# EAGLE schematic BlueBoard_v1 (EAGLE 6.2)

## Sheet 1 of 6: Microcontroller
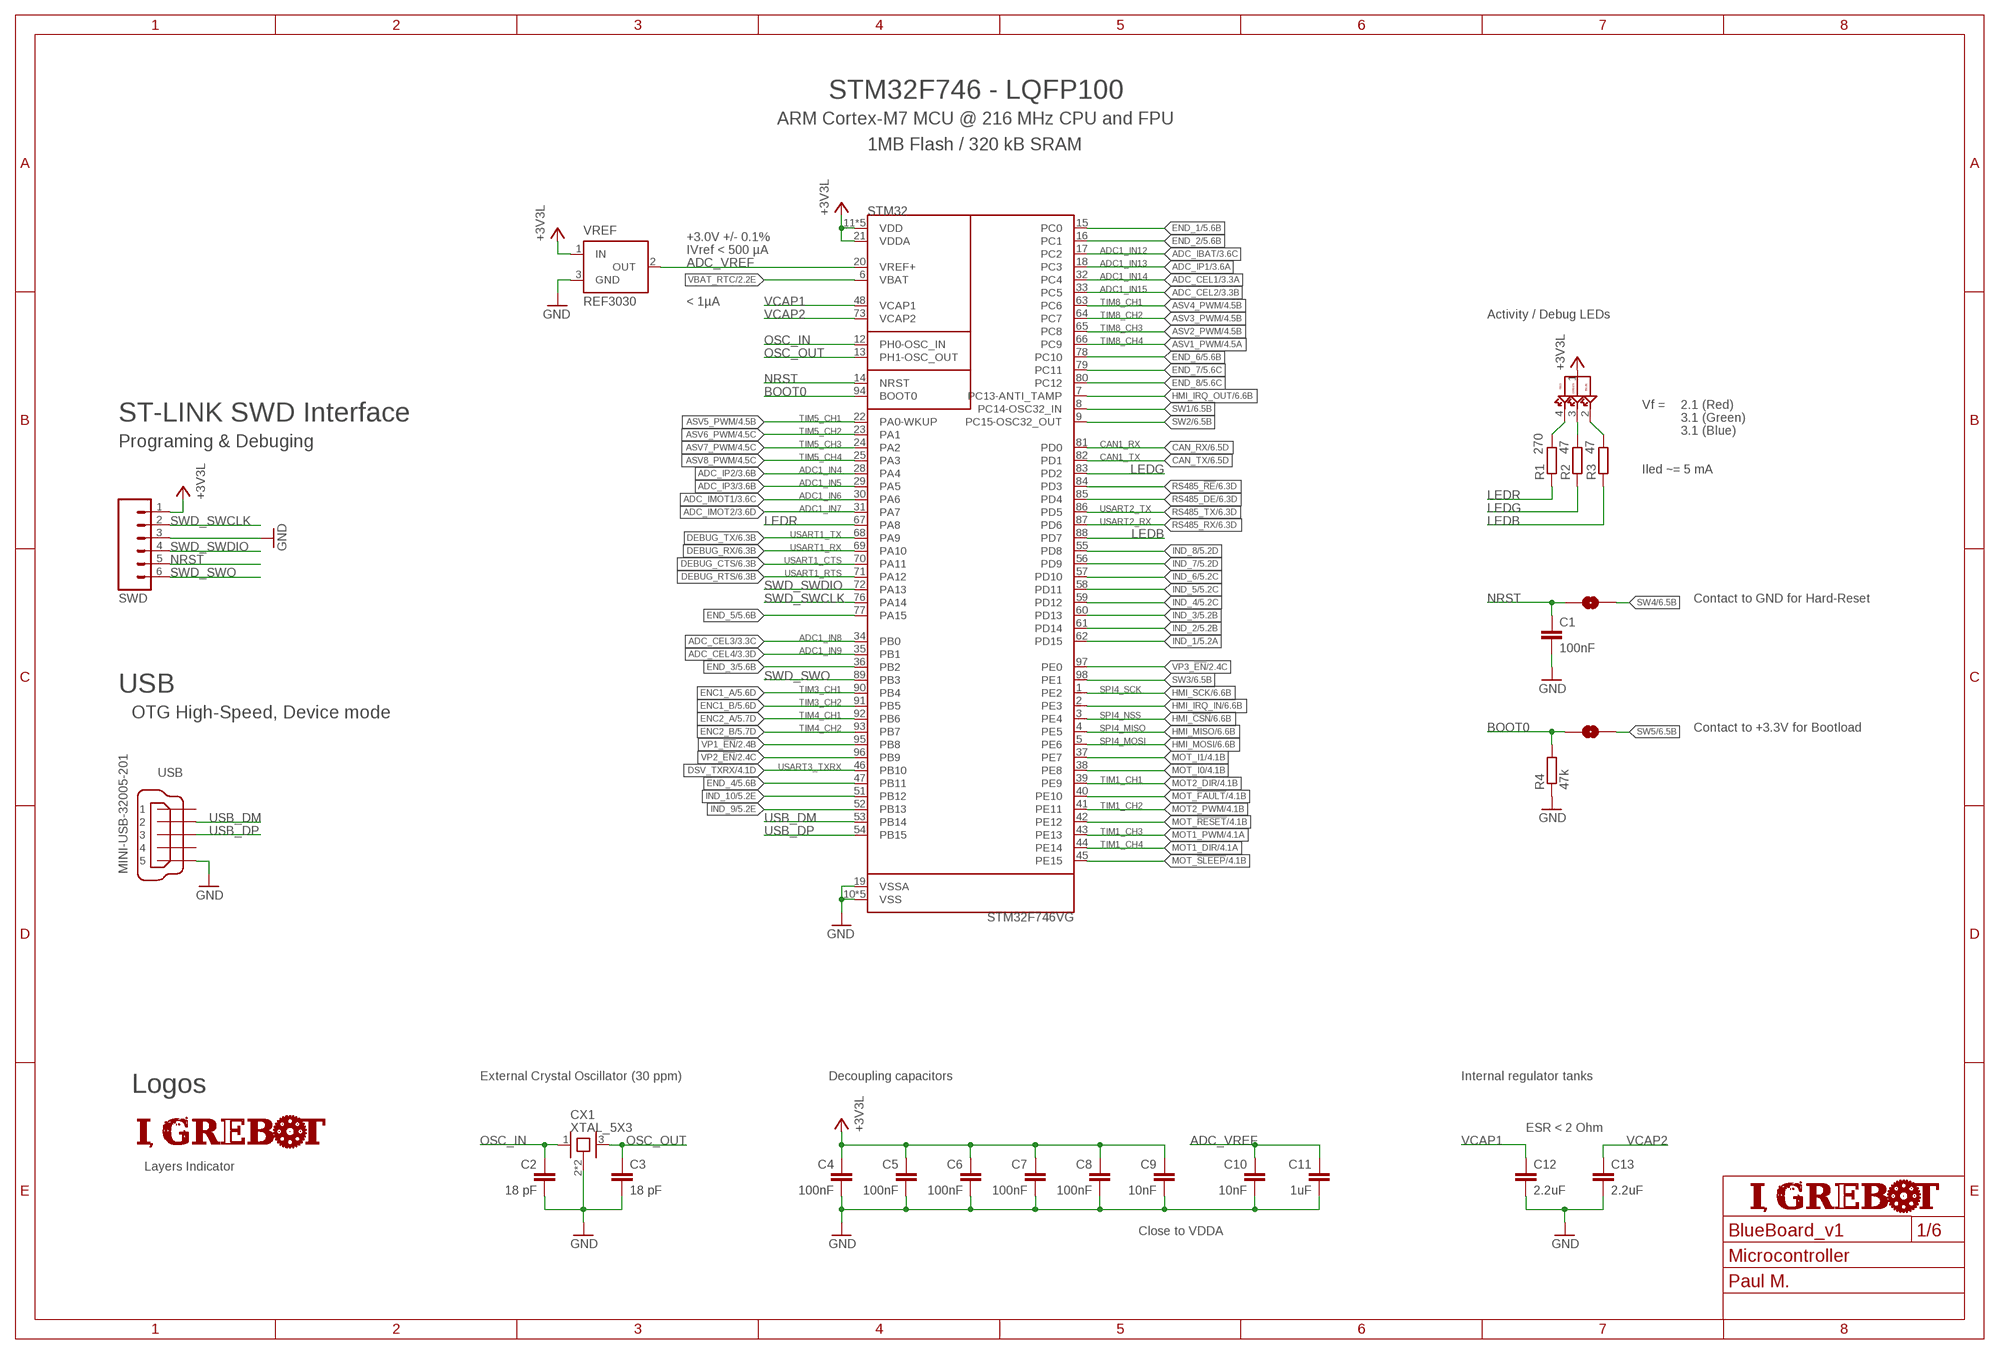
[diagram p0: schematic, sheet 1]
POWER-SUPPLIES1 (FRAME_A3): AUTHOR: Paul M.; SHEET_NAME: Microcontroller

### Parts
C1  100nF  C-EUC0603  [C0603]
C2  18 pF  C-EUC0603  [C0603]
C3  18 pF  C-EUC0603  [C0603]
C4  100nF  C-EUC0603  [C0603]
C5  100nF  C-EUC0603  [C0603]
C6  100nF  C-EUC0603  [C0603]
C7  100nF  C-EUC0603  [C0603]
C8  100nF  C-EUC0603  [C0603]
C9  10nF  C-EUC0603  [C0603]
C10  10nF  C-EUC0603  [C0603]
C11  1uF  C-EUC0805  [C0805]
C12  2.2uF  C-EUC0805  [C0805]
C13  2.2uF  C-EUC0805  [C0805]
CX1  XTAL_5X3  [CRYSTAL-OSC-SMD-5X3]
LED1  ASMB-MTB0-0A3A2  [PLCC4]
LOGO_IGREBOT  LOGO_IGREBOT12X2MM  [IGREBOT_12X2MM]
LOGO_LAYERS  LAYERS_CHECK4_LAYERS  [LAYERS_CHECK_4]
R1  270  R-EU_R0603  [R0603]
R2  47  R-EU_R0603  [R0603]
R3  47  R-EU_R0603  [R0603]
R4  47k  R-EU_R0603  [R0603]
SJ1  SOLDERJUMPERNC2  [SJ_2S-NOTRACE]
SJ2  SOLDERJUMPERNC2  [SJ_2S-NOTRACE]
STM32  STM32F746VG  [LQFP_100]
SWD  M06LOCK  [1X06_LOCK]
USB  MINI-USB-32005-201  [32005-201]
VREF  REF3030  MAX6520  [SOT23]

### Nets
+3V3L: C4.1 C5.1 C6.1 C7.1 C8.1 C9.1 LED1.1(A) STM32.11(VDD) STM32.21(VDDA) STM32.27(VDD) STM32.50(VDD) STM32.75(VDD) STM32.100(VDD) SWD.1 VREF.1(IN) ; also sheet 2,3,4,5,6
ADC_CEL1: STM32.32(PC4) ; also sheet 3
ADC_CEL2: STM32.33(PC5) ; also sheet 3
ADC_CEL3: STM32.34(PB0) ; also sheet 3
ADC_CEL4: STM32.35(PB1) ; also sheet 3
ADC_IBAT: STM32.17(PC2) ; also sheet 3
ADC_IMOT1: STM32.30(PA6) ; also sheet 3
ADC_IMOT2: STM32.31(PA7) ; also sheet 3
ADC_IP1: STM32.18(PC3) ; also sheet 3
ADC_IP2: STM32.28(PA4) ; also sheet 3
ADC_IP3: STM32.29(PA5) ; also sheet 3
ADC_VREF: C10.1 C11.1 STM32.20(VREF+) VREF.2(OUT)
ASV1_PWM: STM32.66(PC9) ; also sheet 4
ASV2_PWM: STM32.65(PC8) ; also sheet 4
ASV3_PWM: STM32.64(PC7) ; also sheet 4
ASV4_PWM: STM32.63(PC6) ; also sheet 4
ASV5_PWM: STM32.22(PA0-WKUP) ; also sheet 4
ASV6_PWM: STM32.23(PA1) ; also sheet 4
ASV7_PWM: STM32.24(PA2) ; also sheet 4
ASV8_PWM: STM32.25(PA3) ; also sheet 4
BOOT0: R4.2 SJ2.1 STM32.94(BOOT0)
CAN_RX: STM32.81(PD0) ; also sheet 6
CAN_TX: STM32.82(PD1) ; also sheet 6
DEBUG_CTS: STM32.70(PA11) ; also sheet 6
DEBUG_RTS: STM32.71(PA12) ; also sheet 6
DEBUG_RX: STM32.69(PA10) ; also sheet 6
DEBUG_TX: STM32.68(PA9) ; also sheet 6
DSV_TXRX: STM32.46(PB10) ; also sheet 4
ENC1_A: STM32.90(PB4) ; also sheet 5
ENC1_B: STM32.91(PB5) ; also sheet 5
ENC2_A: STM32.92(PB6) ; also sheet 5
ENC2_B: STM32.93(PB7) ; also sheet 5
END_1: STM32.15(PC0) ; also sheet 5
END_2: STM32.16(PC1) ; also sheet 5
END_3: STM32.36(PB2) ; also sheet 5
END_4: STM32.47(PB11) ; also sheet 5
END_5: STM32.77(PA15) ; also sheet 5
END_6: STM32.78(PC10) ; also sheet 5
END_7: STM32.79(PC11) ; also sheet 5
END_8: STM32.80(PC12) ; also sheet 5
GND: C1.2 C2.2 C3.2 C4.2 C5.2 C6.2 C7.2 C8.2 C9.2 C10.2 C11.2 C12.2 C13.2 CX1.2 CX1.4 R4.1 STM32.10(VSS) STM32.19(VSSA) STM32.26(VSS) STM32.49(VSS) STM32.74(VSS) STM32.99(VSS) SWD.3 USB.5 VREF.3(GND) ; also sheet 2,3,4,5,6
HMI_!CSN!: STM32.3(PE4) ; also sheet 6
HMI_IRQ_IN: STM32.2(PE3) ; also sheet 6
HMI_IRQ_OUT: STM32.7(PC13-ANTI_TAMP) ; also sheet 6
HMI_MISO: STM32.4(PE5) ; also sheet 6
HMI_MOSI: STM32.5(PE6) ; also sheet 6
HMI_SCK: STM32.1(PE2) ; also sheet 6
IND_1: STM32.62(PD15) ; also sheet 5
IND_2: STM32.61(PD14) ; also sheet 5
IND_3: STM32.60(PD13) ; also sheet 5
IND_4: STM32.59(PD12) ; also sheet 5
IND_5: STM32.58(PD11) ; also sheet 5
IND_6: STM32.57(PD10) ; also sheet 5
IND_7: STM32.56(PD9) ; also sheet 5
IND_8: STM32.55(PD8) ; also sheet 5
IND_9: STM32.52(PB13) ; also sheet 5
IND_10: STM32.51(PB12) ; also sheet 5
LEDB: R3.1 STM32.88(PD7)
LEDG: R2.1 STM32.83(PD2)
LEDR: R1.1 STM32.67(PA8)
MOT1_DIR: STM32.44(PE14) ; also sheet 4
MOT1_PWM: STM32.43(PE13) ; also sheet 4
MOT2_DIR: STM32.39(PE9) ; also sheet 4
MOT2_PWM: STM32.41(PE11) ; also sheet 4
MOT_!FAULT!: STM32.40(PE10) ; also sheet 4
MOT_!RESET!: STM32.42(PE12) ; also sheet 4
MOT_!SLEEP!: STM32.45(PE15) ; also sheet 4
MOT_I0: STM32.38(PE8) ; also sheet 4
MOT_I1: STM32.37(PE7) ; also sheet 4
N$9: LED1.4(CR) R1.2
N$10: LED1.3(CG) R2.2
N$11: LED1.2(CB) R3.2
NRST: C1.1 SJ1.1 STM32.14(NRST) SWD.5
OSC_IN: C2.1 CX1.1 STM32.12(PH0-OSC_IN)
OSC_OUT: C3.1 CX1.3 STM32.13(PH1-OSC_OUT)
RS485_!RE!: STM32.84(PD3) ; also sheet 6
RS485_DE: STM32.85(PD4) ; also sheet 6
RS485_RX: STM32.87(PD6) ; also sheet 6
RS485_TX: STM32.86(PD5) ; also sheet 6
SW1: STM32.8(PC14-OSC32_IN) ; also sheet 6
SW2: STM32.9(PC15-OSC32_OUT) ; also sheet 6
SW3: STM32.98(PE1) ; also sheet 6
SW4: SJ1.2 ; also sheet 6
SW5: SJ2.2 ; also sheet 6
SWD_SWCLK: STM32.76(PA14) SWD.2
SWD_SWDIO: STM32.72(PA13) SWD.4
SWD_SWO: STM32.89(PB3) SWD.6
USB_DM: STM32.53(PB14) USB.2
USB_DP: STM32.54(PB15) USB.3
VBAT_RTC: STM32.6(VBAT) ; also sheet 2
VCAP1: C12.1 STM32.48(VCAP1)
VCAP2: C13.1 STM32.73(VCAP2)
VP1_!EN!: STM32.95(PB8) ; also sheet 2
VP2_!EN!: STM32.96(PB9) ; also sheet 2
VP3_!EN!: STM32.97(PE0) ; also sheet 2
Unconnected: USB.1 USB.4

### Notes on the sheet
- STM32F746 - LQFP100
- ARM Cortex-M7 MCU @ 216 MHz CPU and FPU
- 1MB Flash / 320 kB SRAM
- +3.0V +/- 0.1%
- IVref < 500 µA | ADC1_IN12
- ADC1_IN13
- ADC1_IN14
- ADC1_IN15
- < 1µA | TIM8_CH1
- TIM8_CH2 | Activity / Debug LEDs
- TIM8_CH3
- TIM8_CH4
- Vf = | 2.1 (Red)
- ST-LINK SWD Interface | TIM5_CH1 | 3.1 (Green)
- TIM5_CH2 | 3.1 (Blue)
- Programing & Debuging | TIM5_CH3 | CAN1_RX
- TIM5_CH4 | CAN1_TX
- ADC1_IN4 | Iled ~= 5 mA
- ADC1_IN5
- ADC1_IN6
- ADC1_IN7 | USART2_TX
- USART2_RX
- USART1_TX
- USART1_RX
- USART1_CTS
- USART1_RTS
- Contact to GND for Hard-Reset
- ADC1_IN8
- ADC1_IN9
- USB | TIM3_CH1 | SPI4_SCK
- TIM3_CH2
- OTG High-Speed, Device mode | TIM4_CH1 | SPI4_NSS
- TIM4_CH2 | SPI4_MISO | Contact to +3.3V for Bootload
- SPI4_MOSI
- USART3_TXRX
- TIM1_CH1
- TIM1_CH2
- TIM1_CH3
- TIM1_CH4
- External Crystal Oscillator (30 ppm) | Decoupling capacitors | Internal regulator tanks
- Logos
- ESR < 2 Ohm
- Close to VDDA

## Sheet 2 of 6: Power-Supplies
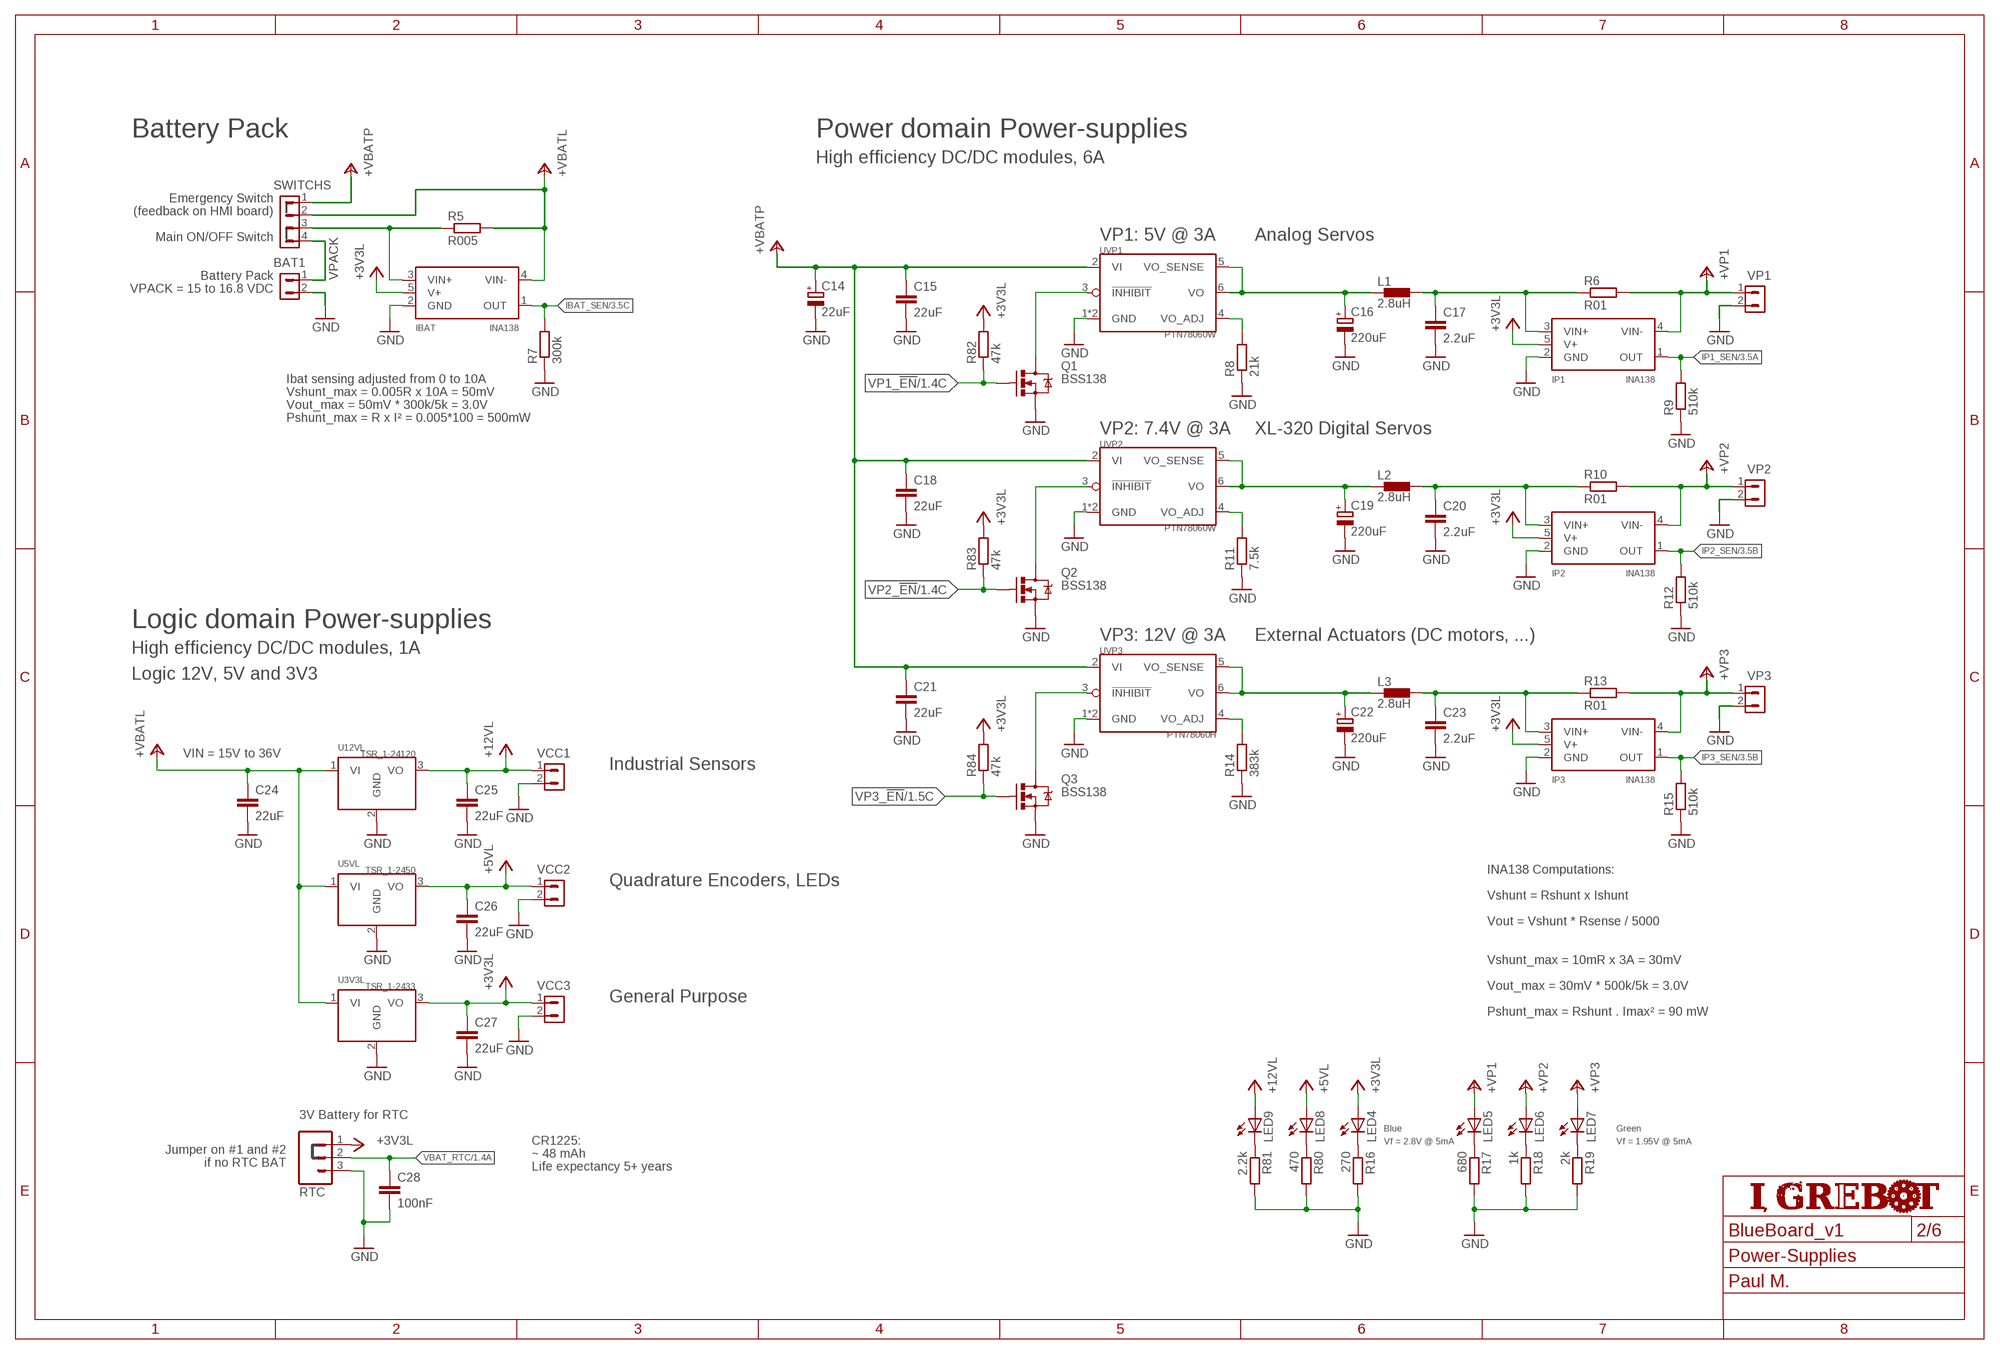
[diagram p1: schematic, sheet 2]
POWER-SUPPLIES (FRAME_A3): AUTHOR: Paul M.; SHEET_NAME: Power-Supplies

### Parts
BAT1  MC15-GF-3.81-LR_2  [CON_3.81_LR_2]
C14  22uF  CPOL-EUB  [PANASONIC_B]
C15  22uF  C-EUC3225  [C3225]
C16  220uF  CPOL-EUD  [PANASONIC_D]
C17  2.2uF  C-EUC3225  [C3225]
C18  22uF  C-EUC3225  [C3225]
C19  220uF  CPOL-EUD  [PANASONIC_D]
C20  2.2uF  C-EUC3225  [C3225]
C21  22uF  C-EUC3225  [C3225]
C22  220uF  CPOL-EUD  [PANASONIC_D]
C23  2.2uF  C-EUC3225  [C3225]
C24  22uF  C-EUC3225  [C3225]
C25  22uF  C-EUC1210  [C1210]
C26  22uF  C-EUC1210  [C1210]
C27  22uF  C-EUC1210  [C1210]
C28  100nF  C-EUC0603  [C0603]
IBAT  INA138  [DBV_05]
IP1  INA138  [DBV_05]
IP2  INA138  [DBV_05]
IP3  INA138  [DBV_05]
L1  2.8uH  DR1030  [DR1030]
L2  2.8uH  DR1030  [DR1030]
L3  2.8uH  DR1030  [DR1030]
LED4  LEDCHIP-LED0805  [CHIP-LED0805]
LED5  LEDCHIP-LED0805  [CHIP-LED0805]
LED6  LEDCHIP-LED0805  [CHIP-LED0805]
LED7  LEDCHIP-LED0805  [CHIP-LED0805]
LED8  LEDCHIP-LED0805  [CHIP-LED0805]
LED9  LEDCHIP-LED0805  [CHIP-LED0805]
Q1  BSS138  MOSFET-NCHANNELBSS138  [SOT23]
Q2  BSS138  MOSFET-NCHANNELBSS138  [SOT23]
Q3  BSS138  MOSFET-NCHANNELBSS138  [SOT23]
R5  R005  R-EU_R2512  [R2512]
R6  R01  R-EU_R2512  [R2512]
R7  300k  R-EU_R0603  [R0603]
R8  21k  R-EU_R0603  [R0603]
R9  510k  R-EU_R0603  [R0603]
R10  R01  R-EU_R2512  [R2512]
R11  7.5k  R-EU_R0603  [R0603]
R12  510k  R-EU_R0603  [R0603]
R13  R01  R-EU_R2512  [R2512]
R14  383k  R-EU_R0603  [R0603]
R15  510k  R-EU_R0603  [R0603]
R16  270  R-EU_R0603  [R0603]
R17  680  R-EU_R0603  [R0603]
R18  1k  R-EU_R0603  [R0603]
R19  2k  R-EU_R0603  [R0603]
R80  470  R-EU_R0603  [R0603]
R81  2.2k  R-EU_R0603  [R0603]
R82  47k  R-EU_R0603  [R0603]
R83  47k  R-EU_R0603  [R0603]
R84  47k  R-EU_R0603  [R0603]
RTC  M03LOCK  [1X03_LOCK]
SWITCHS  MC15-GF-3.81-LR_4  [CON_3.81_LR_4]
U3V3L  TSR_1-2433  TSR_1-24XX  [TSR1]
U5VL  TSR_1-2450  TSR_1-24XX  [TSR1]
U12VL  TSR_1-24120  TSR_1-24XX  [TSR1]
UVP1  PTN78060W  [PTN78060]
UVP2  PTN78060W  [PTN78060]
UVP3  PTN78060H  PTN78060W  [PTN78060]
VCC1  CON_3.5_2  [CON_3.5_2]
VCC2  CON_3.5_2  [CON_3.5_2]
VCC3  CON_3.5_2  [CON_3.5_2]
VP1  CON_3.5_2  [CON_3.5_2]
VP2  CON_3.5_2  [CON_3.5_2]
VP3  CON_3.5_2  [CON_3.5_2]

### Nets
!INHIBIT!_VP1: Q1.3(D) UVP1.3(!INHIBIT!)
!INHIBIT!_VP5: Q2.3(D) UVP2.3(!INHIBIT!)
!INHIBIT!_VP6: Q3.3(D) UVP3.3(!INHIBIT!)
+3V3L: C27.1 IBAT.5(V+) IP1.5(V+) IP2.5(V+) IP3.5(V+) LED4.A R82.2 R83.2 R84.2 RTC.1 U3V3L.3(VO) VCC3.1 ; also sheet 1,3,4,5,6
+5VL: C26.1 LED8.A U5VL.3(VO) VCC2.1 ; also sheet 3,5,6
+12VL: C25.1 LED9.A U12VL.3(VO) VCC1.1 ; also sheet 5
+VBATL: C24.1 IBAT.4(VIN-) R5.2 SWITCHS.2 U3V3L.1(VI) U5VL.1(VI) U12VL.1(VI)
+VBATP: C14.+ C15.1 C18.1 C21.1 SWITCHS.1 UVP1.2(VI) UVP2.2(VI) UVP3.2(VI) ; also sheet 4
+VP1: IP1.4(VIN-) LED5.A R6.2 VP1.1 ; also sheet 4
+VP2: IP2.4(VIN-) LED6.A R10.2 VP2.1 ; also sheet 4
+VP3: IP3.4(VIN-) LED7.A R13.2 VP3.1
GND: BAT1.2 C14.- C15.2 C16.- C17.2 C18.2 C19.- C20.2 C21.2 C22.- C23.2 C24.2 C25.2 C26.2 C27.2 C28.2 IBAT.2(GND) IP1.2(GND) IP2.2(GND) IP3.2(GND) Q1.2(S) Q2.2(S) Q3.2(S) R7.1 R8.1 R9.1 R11.1 R12.1 R14.1 R15.1 R16.2 R17.2 R18.2 R19.2 R80.2 R81.2 RTC.3 U3V3L.2(GND) U5VL.2(GND) U12VL.2(GND) UVP1.1(GND) UVP1.7(GND) UVP2.1(GND) UVP2.7(GND) UVP3.1(GND) UVP3.7(GND) VCC1.2 VCC2.2 VCC3.2 VP1.2 VP2.2 VP3.2 ; also sheet 1,3,4,5,6
IBAT_SEN: IBAT.1(OUT) R7.2 ; also sheet 3
IP1_SEN: IP1.1(OUT) R9.2 ; also sheet 3
IP2_SEN: IP2.1(OUT) R12.2 ; also sheet 3
IP3_SEN: IP3.1(OUT) R15.2 ; also sheet 3
N$1: C16.+ L1.1 UVP1.5(VO_SENSE) UVP1.6(VO)
N$3: C17.1 IP1.3(VIN+) L1.2 R6.1
N$4: R14.2 UVP3.4(VO_ADJ)
N$6: R11.2 UVP2.4(VO_ADJ)
N$7: C19.+ L2.1 UVP2.5(VO_SENSE) UVP2.6(VO)
N$8: R8.2 UVP1.4(VO_ADJ)
N$12: C20.1 IP2.3(VIN+) L2.2 R10.1
N$13: C22.+ L3.1 UVP3.5(VO_SENSE) UVP3.6(VO)
N$14: C23.1 IP3.3(VIN+) L3.2 R13.1
N$15: LED8.C R80.1
N$16: LED9.C R81.1
N$39: LED5.C R17.1
N$40: LED4.C R16.1
N$41: LED6.C R18.1
N$42: LED7.C R19.1
N$43: IBAT.3(VIN+) R5.1 SWITCHS.3
VBAT_RTC: C28.1 RTC.2 ; also sheet 1
VP1_!EN!: Q1.1(G) R82.1 ; also sheet 1
VP2_!EN!: Q2.1(G) R83.1 ; also sheet 1
VP3_!EN!: Q3.1(G) R84.1 ; also sheet 1
VPACK: BAT1.1 SWITCHS.4

### Notes on the sheet
- Battery Pack | Power domain Power-supplies
- High efficiency DC/DC modules, 6A
- Emergency Switch
- (feedback on HMI board)
- Main ON/OFF Switch | VP1: 5V @ 3A | Analog Servos
- Battery Pack
- VPACK = 15 to 16.8 VDC
- Ibat sensing adjusted from 0 to 10A
- Vshunt_max = 0.005R x 10A = 50mV
- Vout_max = 50mV * 300k/5k = 3.0V
- Pshunt_max = R x I² = 0.005*100 = 500mW
- VP2: 7.4V @ 3A | XL-320 Digital Servos
- Logic domain Power-supplies
- VP3: 12V @ 3A | External Actuators (DC motors, ...)
- High efficiency DC/DC modules, 1A
- Logic 12V, 5V and 3V3
- VIN = 15V to 36V
- Industrial Sensors
- INA138 Computations:
- Quadrature Encoders, LEDs
- Vshunt = Rshunt x Ishunt
- Vout = Vshunt * Rsense / 5000
- Vshunt_max = 10mR x 3A = 30mV
- Vout_max = 30mV * 500k/5k = 3.0V
- General Purpose
- Pshunt_max = Rshunt . Imax² = 90 mW
- 3V Battery for RTC
- Blue | Green
- Jumper on #1 and #2 | CR1225: | Vf = 2.8V @ 5mA | Vf = 1.95V @ 5mA
- if no RTC BAT | ~ 48 mAh
- Life expectancy 5+ years

## Sheet 3 of 6: Monitoring
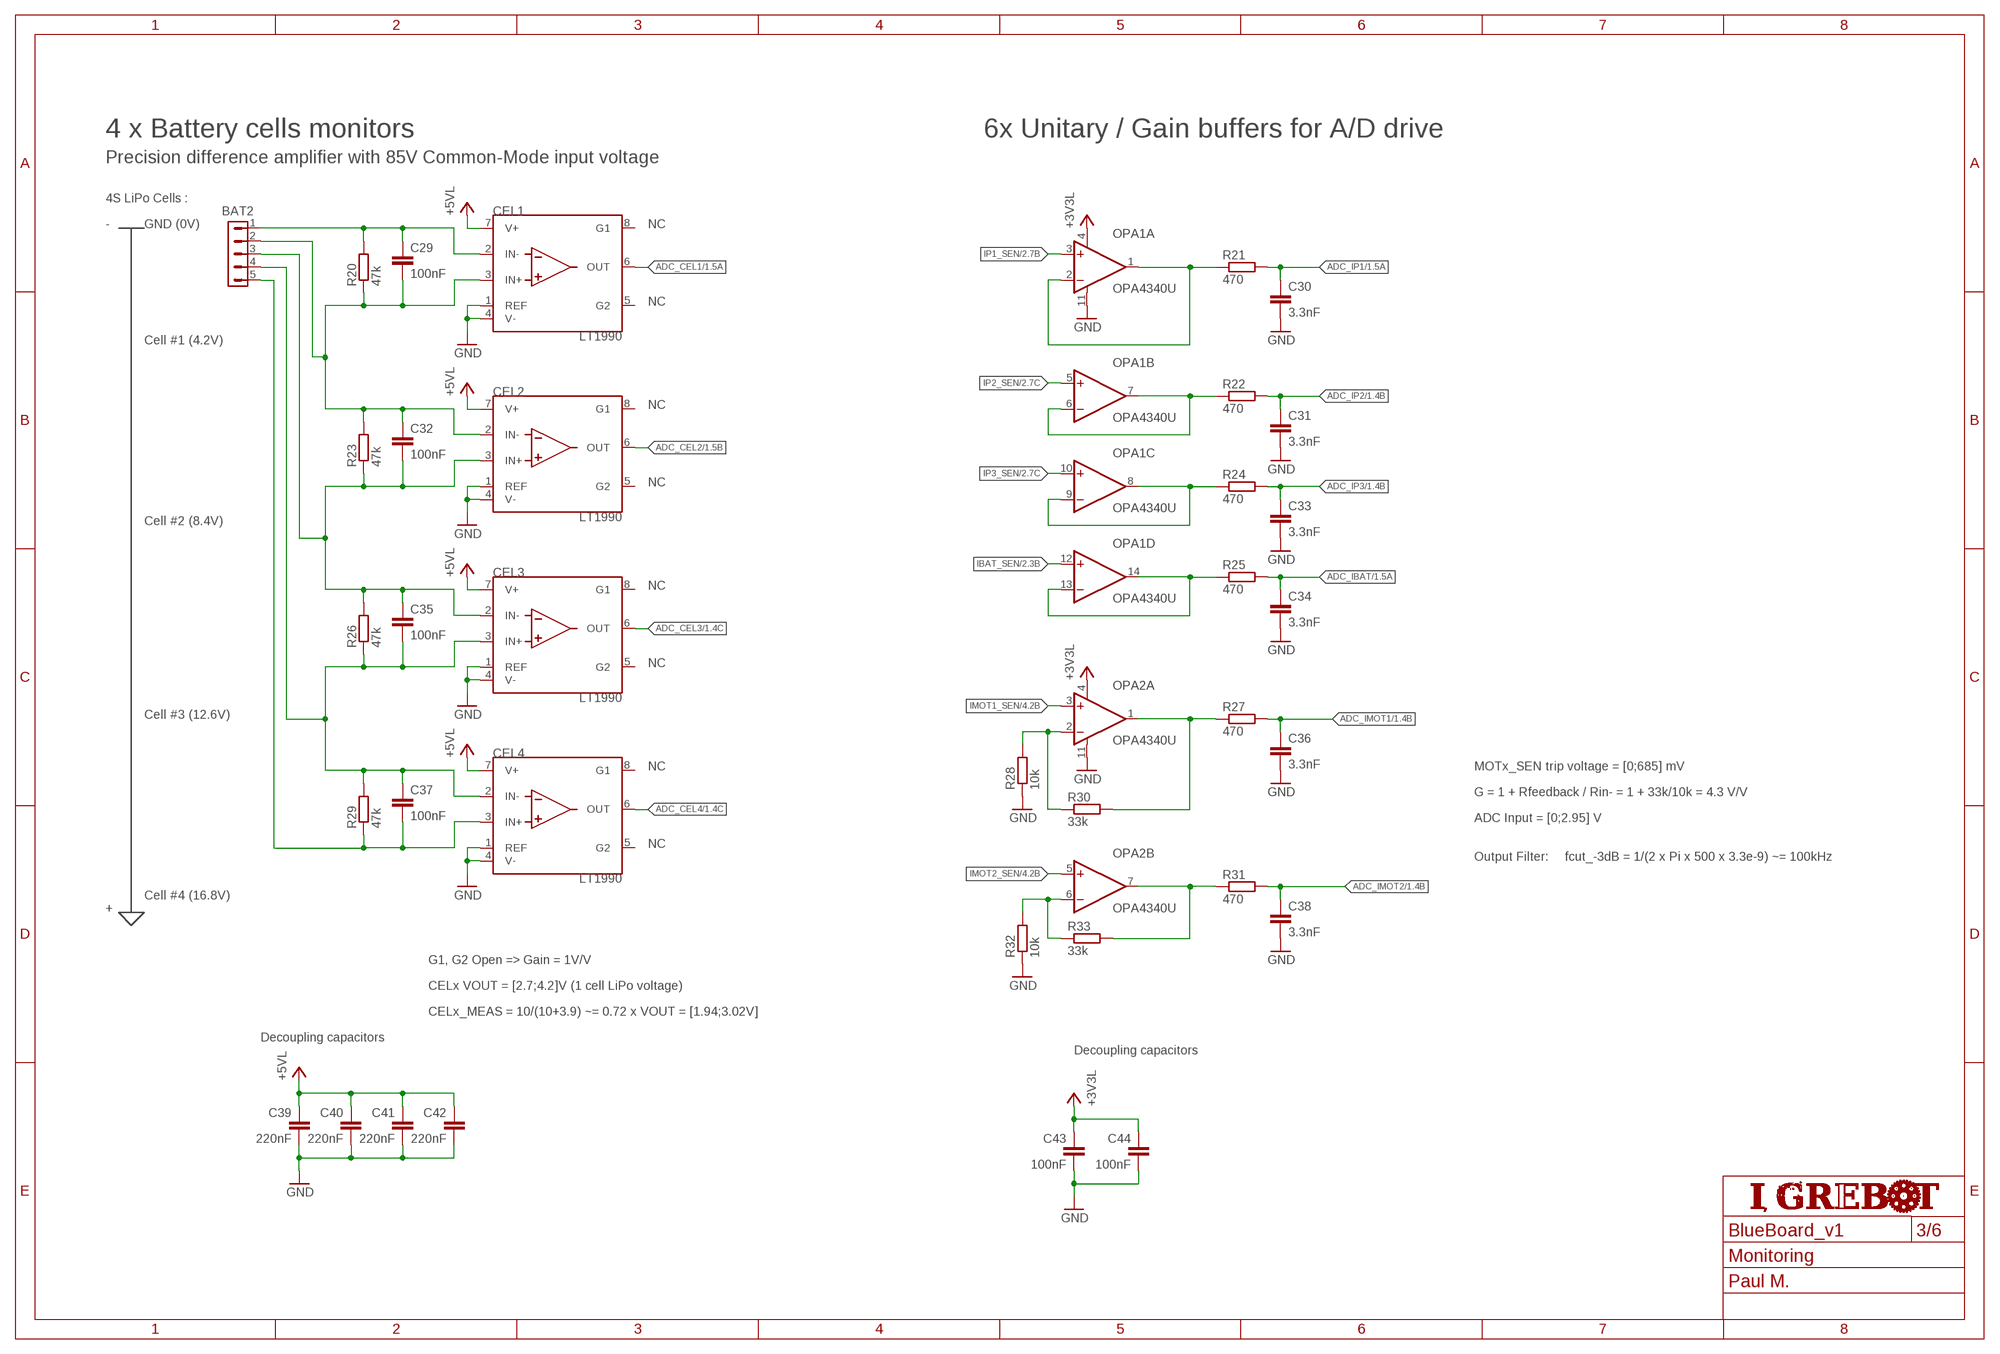
[diagram p2: schematic, sheet 3]
POWER-SUPPLIES2 (FRAME_A3): AUTHOR: Paul M.; SHEET_NAME: Monitoring

### Parts
BAT2  JST-XH-S_5  [JST-XH-5S]
C29  100nF  C-EUC0603  [C0603]
C30  3.3nF  C-EUC0603  [C0603]
C31  3.3nF  C-EUC0603  [C0603]
C32  100nF  C-EUC0603  [C0603]
C33  3.3nF  C-EUC0603  [C0603]
C34  3.3nF  C-EUC0603  [C0603]
C35  100nF  C-EUC0603  [C0603]
C36  3.3nF  C-EUC0603  [C0603]
C37  100nF  C-EUC0603  [C0603]
C38  3.3nF  C-EUC0603  [C0603]
C39  220nF  C-EUC0603  [C0603]
C40  220nF  C-EUC0603  [C0603]
C41  220nF  C-EUC0603  [C0603]
C42  220nF  C-EUC0603  [C0603]
C43  100nF  C-EUC0603  [C0603]
C44  100nF  C-EUC0603  [C0603]
CEL1  LT1990  [S8]
CEL2  LT1990  [S8]
CEL3  LT1990  [S8]
CEL4  LT1990  [S8]
OPA1  OPA4340U  [SO14]
OPA2  OPA4340U  [SO14]
R20  47k  R-EU_R0603  [R0603]
R21  470  R-EU_R0603  [R0603]
R22  470  R-EU_R0603  [R0603]
R23  47k  R-EU_R0603  [R0603]
R24  470  R-EU_R0603  [R0603]
R25  470  R-EU_R0603  [R0603]
R26  47k  R-EU_R0603  [R0603]
R27  470  R-EU_R0603  [R0603]
R28  10k  R-EU_R0603  [R0603]
R29  47k  R-EU_R0603  [R0603]
R30  33k  R-EU_R0603  [R0603]
R31  470  R-EU_R0603  [R0603]
R32  10k  R-EU_R0603  [R0603]
R33  33k  R-EU_R0603  [R0603]

### Nets
+3V3L: C43.1 C44.1 OPA1.4(A:V+) OPA2.4(A:V+) ; also sheet 1,2,4,5,6
+5VL: C39.1 C40.1 C41.1 C42.1 CEL1.7(V+) CEL2.7(V+) CEL3.7(V+) CEL4.7(V+) ; also sheet 2,5,6
ADC_CEL1: CEL1.6(OUT) ; also sheet 1
ADC_CEL2: CEL2.6(OUT) ; also sheet 1
ADC_CEL3: CEL3.6(OUT) ; also sheet 1
ADC_CEL4: CEL4.6(OUT) ; also sheet 1
ADC_IBAT: C34.1 R25.2 ; also sheet 1
ADC_IMOT1: C36.1 R27.2 ; also sheet 1
ADC_IMOT2: C38.1 R31.2 ; also sheet 1
ADC_IP1: C30.1 R21.2 ; also sheet 1
ADC_IP2: C31.1 R22.2 ; also sheet 1
ADC_IP3: C33.1 R24.2 ; also sheet 1
GND: C30.2 C31.2 C33.2 C34.2 C36.2 C38.2 C39.2 C40.2 C41.2 C42.2 C43.2 C44.2 CEL1.1(REF) CEL1.4(V-) CEL2.1(REF) CEL2.4(V-) CEL3.1(REF) CEL3.4(V-) CEL4.1(REF) CEL4.4(V-) OPA1.11(A:V-) OPA2.11(A:V-) R28.1 R32.1 ; also sheet 1,2,4,5,6
IBAT_SEN: OPA1.12(D:+IN) ; also sheet 2
IMOT1_SEN: OPA2.3(A:+IN) ; also sheet 4
IMOT2_SEN: OPA2.5(B:+IN) ; also sheet 4
IP1_SEN: OPA1.3(A:+IN) ; also sheet 2
IP2_SEN: OPA1.5(B:+IN) ; also sheet 2
IP3_SEN: OPA1.10(C:+IN) ; also sheet 2
N$5: OPA2.2(A:-IN) R28.2 R30.1
N$18: OPA2.6(B:-IN) R32.2 R33.1
N$61: OPA1.1(A:OUT) OPA1.2(A:-IN) R21.1
N$62: OPA1.6(B:-IN) OPA1.7(B:OUT) R22.1
N$63: OPA1.8(C:OUT) OPA1.9(C:-IN) R24.1
N$64: OPA1.13(D:-IN) OPA1.14(D:OUT) R25.1
N$65: OPA2.1(A:OUT) R27.1 R30.2
N$66: OPA2.7(B:OUT) R31.1 R33.2
N$104: BAT2.1 C29.1 CEL1.2(IN-) R20.2
N$105: BAT2.2 C29.2 C32.1 CEL1.3(IN+) CEL2.2(IN-) R20.1 R23.2
N$108: BAT2.3 C32.2 C35.1 CEL2.3(IN+) CEL3.2(IN-) R23.1 R26.2
N$111: BAT2.4 C35.2 C37.1 CEL3.3(IN+) CEL4.2(IN-) R26.1 R29.2
N$114: BAT2.5 C37.2 CEL4.3(IN+) R29.1
Unconnected: CEL1.5(G2) CEL1.8(G1) CEL2.5(G2) CEL2.8(G1) CEL3.5(G2) CEL3.8(G1) CEL4.5(G2) CEL4.8(G1) OPA2.8(C:OUT) OPA2.9(C:-IN) OPA2.10(C:+IN) OPA2.12(D:+IN) OPA2.13(D:-IN) OPA2.14(D:OUT)

### Notes on the sheet
- 4 x Battery cells monitors | 6x Unitary / Gain buffers for A/D drive
- Precision difference amplifier with 85V Common-Mode input voltage
- 4S LiPo Cells :
- - | GND (0V) | NC
- NC
- Cell #1 (4.2V)
- NC
- NC
- Cell #2 (8.4V)
- NC
- NC
- Cell #3 (12.6V)
- NC | MOTx_SEN trip voltage = [0;685] mV
- G = 1 + Rfeedback / Rin- = 1 + 33k/10k = 4.3 V/V
- ADC Input = [0;2.95] V
- NC
- Output Filter: | fcut_-3dB = 1/(2 x Pi x 500 x 3.3e-9) ~= 100kHz
- Cell #4 (16.8V)
- +
- G1, G2 Open => Gain = 1V/V
- CELx VOUT = [2.7;4.2]V (1 cell LiPo voltage)
- CELx_MEAS = 10/(10+3.9) ~= 0.72 x VOUT = [1.94;3.02V]
- Decoupling capacitors
- Decoupling capacitors

## Sheet 4 of 6: Actuators
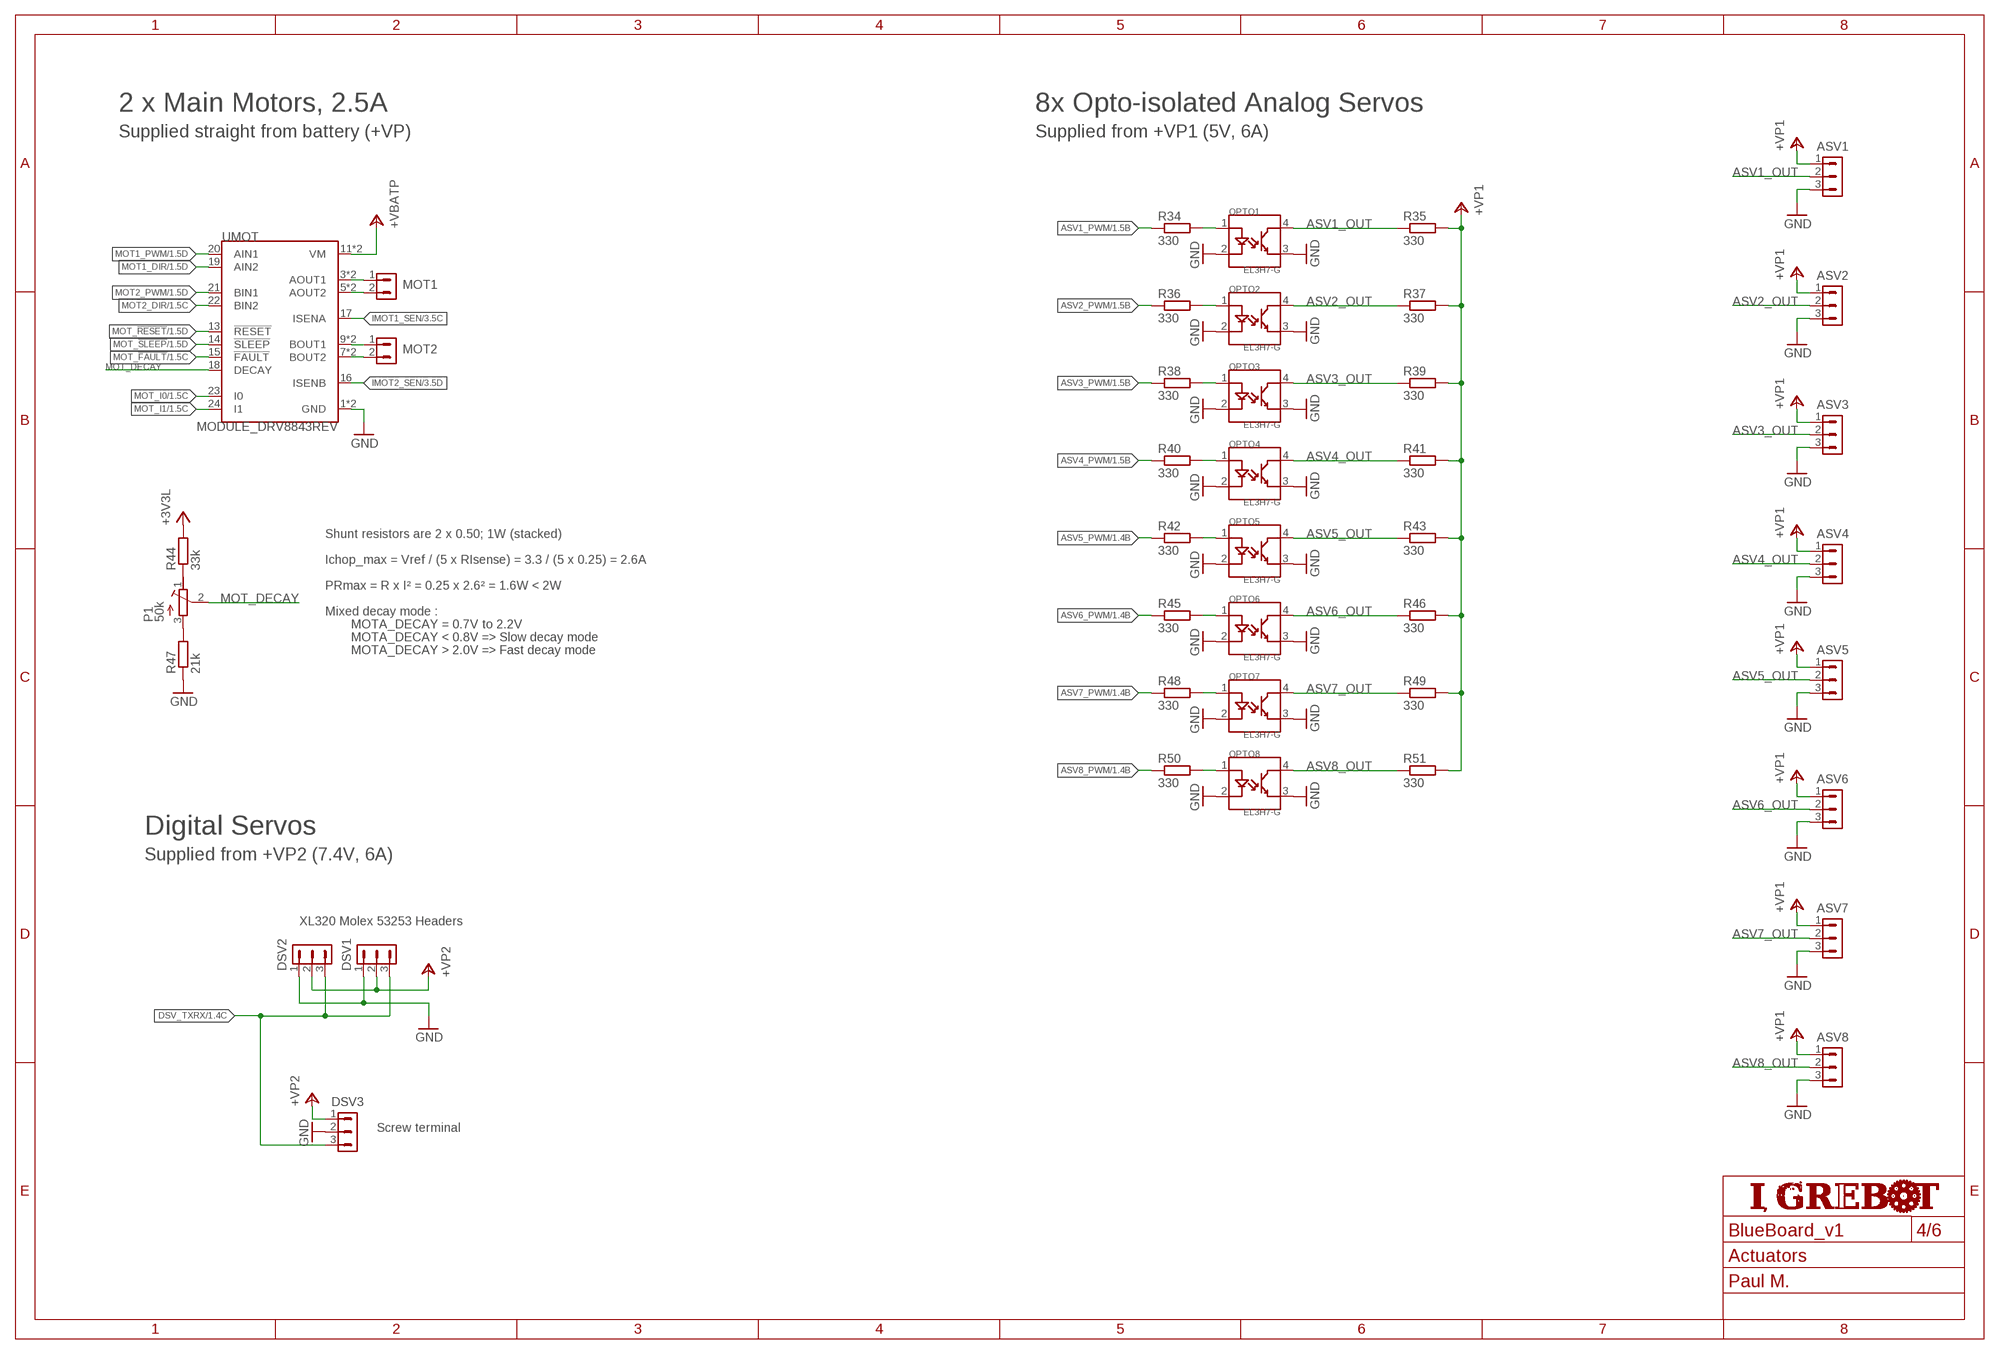
[diagram p3: schematic, sheet 4]
U$5 (FRAME_A3): AUTHOR: Paul M.; SHEET_NAME: Actuators

### Parts
ASV1  CON_3.5_3  [CON_3.5_3]
ASV2  CON_3.5_3  [CON_3.5_3]
ASV3  CON_3.5_3  [CON_3.5_3]
ASV4  CON_3.5_3  [CON_3.5_3]
ASV5  CON_3.5_3  [CON_3.5_3]
ASV6  CON_3.5_3  [CON_3.5_3]
ASV7  CON_3.5_3  [CON_3.5_3]
ASV8  CON_3.5_3  [CON_3.5_3]
DSV1  CON_2.00_MOLEX-53253_3  [CON_2.00_MOLEX-53253_3]
DSV2  CON_2.00_MOLEX-53253_3  [CON_2.00_MOLEX-53253_3]
DSV3  CON_3.5_3  [CON_3.5_3]
MOT1  CON_3.5_2  [CON_3.5_2]
MOT2  CON_3.5_2  [CON_3.5_2]
OPTO1  EL3H7-G  [SSOP_4]
OPTO2  EL3H7-G  [SSOP_4]
OPTO3  EL3H7-G  [SSOP_4]
OPTO4  EL3H7-G  [SSOP_4]
OPTO5  EL3H7-G  [SSOP_4]
OPTO6  EL3H7-G  [SSOP_4]
OPTO7  EL3H7-G  [SSOP_4]
OPTO8  EL3H7-G  [SSOP_4]
P1  50k  R-TRIMMT93XB  [RTRIMT93XB]
R34  330  R-EU_R0603  [R0603]
R35  330  R-EU_R0603  [R0603]
R36  330  R-EU_R0603  [R0603]
R37  330  R-EU_R0603  [R0603]
R38  330  R-EU_R0603  [R0603]
R39  330  R-EU_R0603  [R0603]
R40  330  R-EU_R0603  [R0603]
R41  330  R-EU_R0603  [R0603]
R42  330  R-EU_R0603  [R0603]
R43  330  R-EU_R0603  [R0603]
R44  33k  R-EU_R0603  [R0603]
R45  330  R-EU_R0603  [R0603]
R46  330  R-EU_R0603  [R0603]
R47  21k  R-EU_R0603  [R0603]
R48  330  R-EU_R0603  [R0603]
R49  330  R-EU_R0603  [R0603]
R50  330  R-EU_R0603  [R0603]
R51  330  R-EU_R0603  [R0603]
UMOT  MODULE_DRV8843REV  [MODULE_DRV884X_REV]

### Nets
+3V3L: R44.2 ; also sheet 1,2,3,5,6
+VBATP: UMOT.11(VM) UMOT.12(VM) ; also sheet 2
+VP1: ASV1.1 ASV2.1 ASV3.1 ASV4.1 ASV5.1 ASV6.1 ASV7.1 ASV8.1 R35.2 R37.2 R39.2 R41.2 R43.2 R46.2 R49.2 R51.2 ; also sheet 2
+VP2: DSV1.2 DSV2.2 DSV3.1 ; also sheet 2
ASV1_OUT: ASV1.2 OPTO1.4 R35.1
ASV1_PWM: R34.1 ; also sheet 1
ASV2_OUT: ASV2.2 OPTO2.4 R37.1
ASV2_PWM: R36.1 ; also sheet 1
ASV3_OUT: ASV3.2 OPTO3.4 R39.1
ASV3_PWM: R38.1 ; also sheet 1
ASV4_OUT: ASV4.2 OPTO4.4 R41.1
ASV4_PWM: R40.1 ; also sheet 1
ASV5_OUT: ASV5.2 OPTO5.4 R43.1
ASV5_PWM: R42.1 ; also sheet 1
ASV6_OUT: ASV6.2 OPTO6.4 R46.1
ASV6_PWM: R45.1 ; also sheet 1
ASV7_OUT: ASV7.2 OPTO7.4 R49.1
ASV7_PWM: R48.1 ; also sheet 1
ASV8_OUT: ASV8.2 OPTO8.4 R51.1
ASV8_PWM: R50.1 ; also sheet 1
DSV_TXRX: DSV1.3 DSV2.3 DSV3.3 ; also sheet 1
GND: ASV1.3 ASV2.3 ASV3.3 ASV4.3 ASV5.3 ASV6.3 ASV7.3 ASV8.3 DSV1.1 DSV2.1 DSV3.2 OPTO1.2 OPTO1.3 OPTO2.2 OPTO2.3 OPTO3.2 OPTO3.3 OPTO4.2 OPTO4.3 OPTO5.2 OPTO5.3 OPTO6.2 OPTO6.3 OPTO7.2 OPTO7.3 OPTO8.2 OPTO8.3 R47.1 UMOT.1(GND) UMOT.2(GND) ; also sheet 1,2,3,5,6
IMOT1_SEN: UMOT.17(ISENA) ; also sheet 3
IMOT2_SEN: UMOT.16(ISENB) ; also sheet 3
MOT1_DIR: UMOT.19(AIN2) ; also sheet 1
MOT1_PWM: UMOT.20(AIN1) ; also sheet 1
MOT2_DIR: UMOT.22(BIN2) ; also sheet 1
MOT2_PWM: UMOT.21(BIN1) ; also sheet 1
MOT_!FAULT!: UMOT.15(!FAULT!) ; also sheet 1
MOT_!RESET!: UMOT.13(!RESET!) ; also sheet 1
MOT_!SLEEP!: UMOT.14(!SLEEP!) ; also sheet 1
MOT_DECAY: P1.2(S) UMOT.18(DECAY)
MOT_I0: UMOT.23(I0) ; also sheet 1
MOT_I1: UMOT.24(I1) ; also sheet 1
N$2: OPTO1.1 R34.2
N$32: OPTO2.1 R36.2
N$33: OPTO3.1 R38.2
N$34: OPTO4.1 R40.2
N$35: OPTO5.1 R42.2
N$36: OPTO6.1 R45.2
N$37: OPTO7.1 R48.2
N$38: OPTO8.1 R50.2
N$44: MOT1.1 UMOT.3(AOUT1) UMOT.4(AOUT1)
N$45: MOT1.2 UMOT.5(AOUT2) UMOT.6(AOUT2)
N$46: MOT2.1 UMOT.9(BOUT1) UMOT.10(BOUT1)
N$47: MOT2.2 UMOT.7(BOUT2) UMOT.8(BOUT2)
N$121: P1.3(E) R47.2
N$122: P1.1(A) R44.1

### Notes on the sheet
- 2 x Main Motors, 2.5A | 8x Opto-isolated Analog Servos
- Supplied straight from battery (+VP) | Supplied from +VP1 (5V, 6A)
- Shunt resistors are 2 x 0.50; 1W (stacked)
- Ichop_max = Vref / (5 x RIsense) = 3.3 / (5 x 0.25) = 2.6A
- PRmax = R x I² = 0.25 x 2.6² = 1.6W < 2W
- Mixed decay mode :
- MOTA_DECAY = 0.7V to 2.2V
- MOTA_DECAY < 0.8V => Slow decay mode
- MOTA_DECAY > 2.0V => Fast decay mode
- Digital Servos
- Supplied from +VP2 (7.4V, 6A)
- XL320 Molex 53253 Headers
- Screw terminal

## Sheet 5 of 6: Sensors
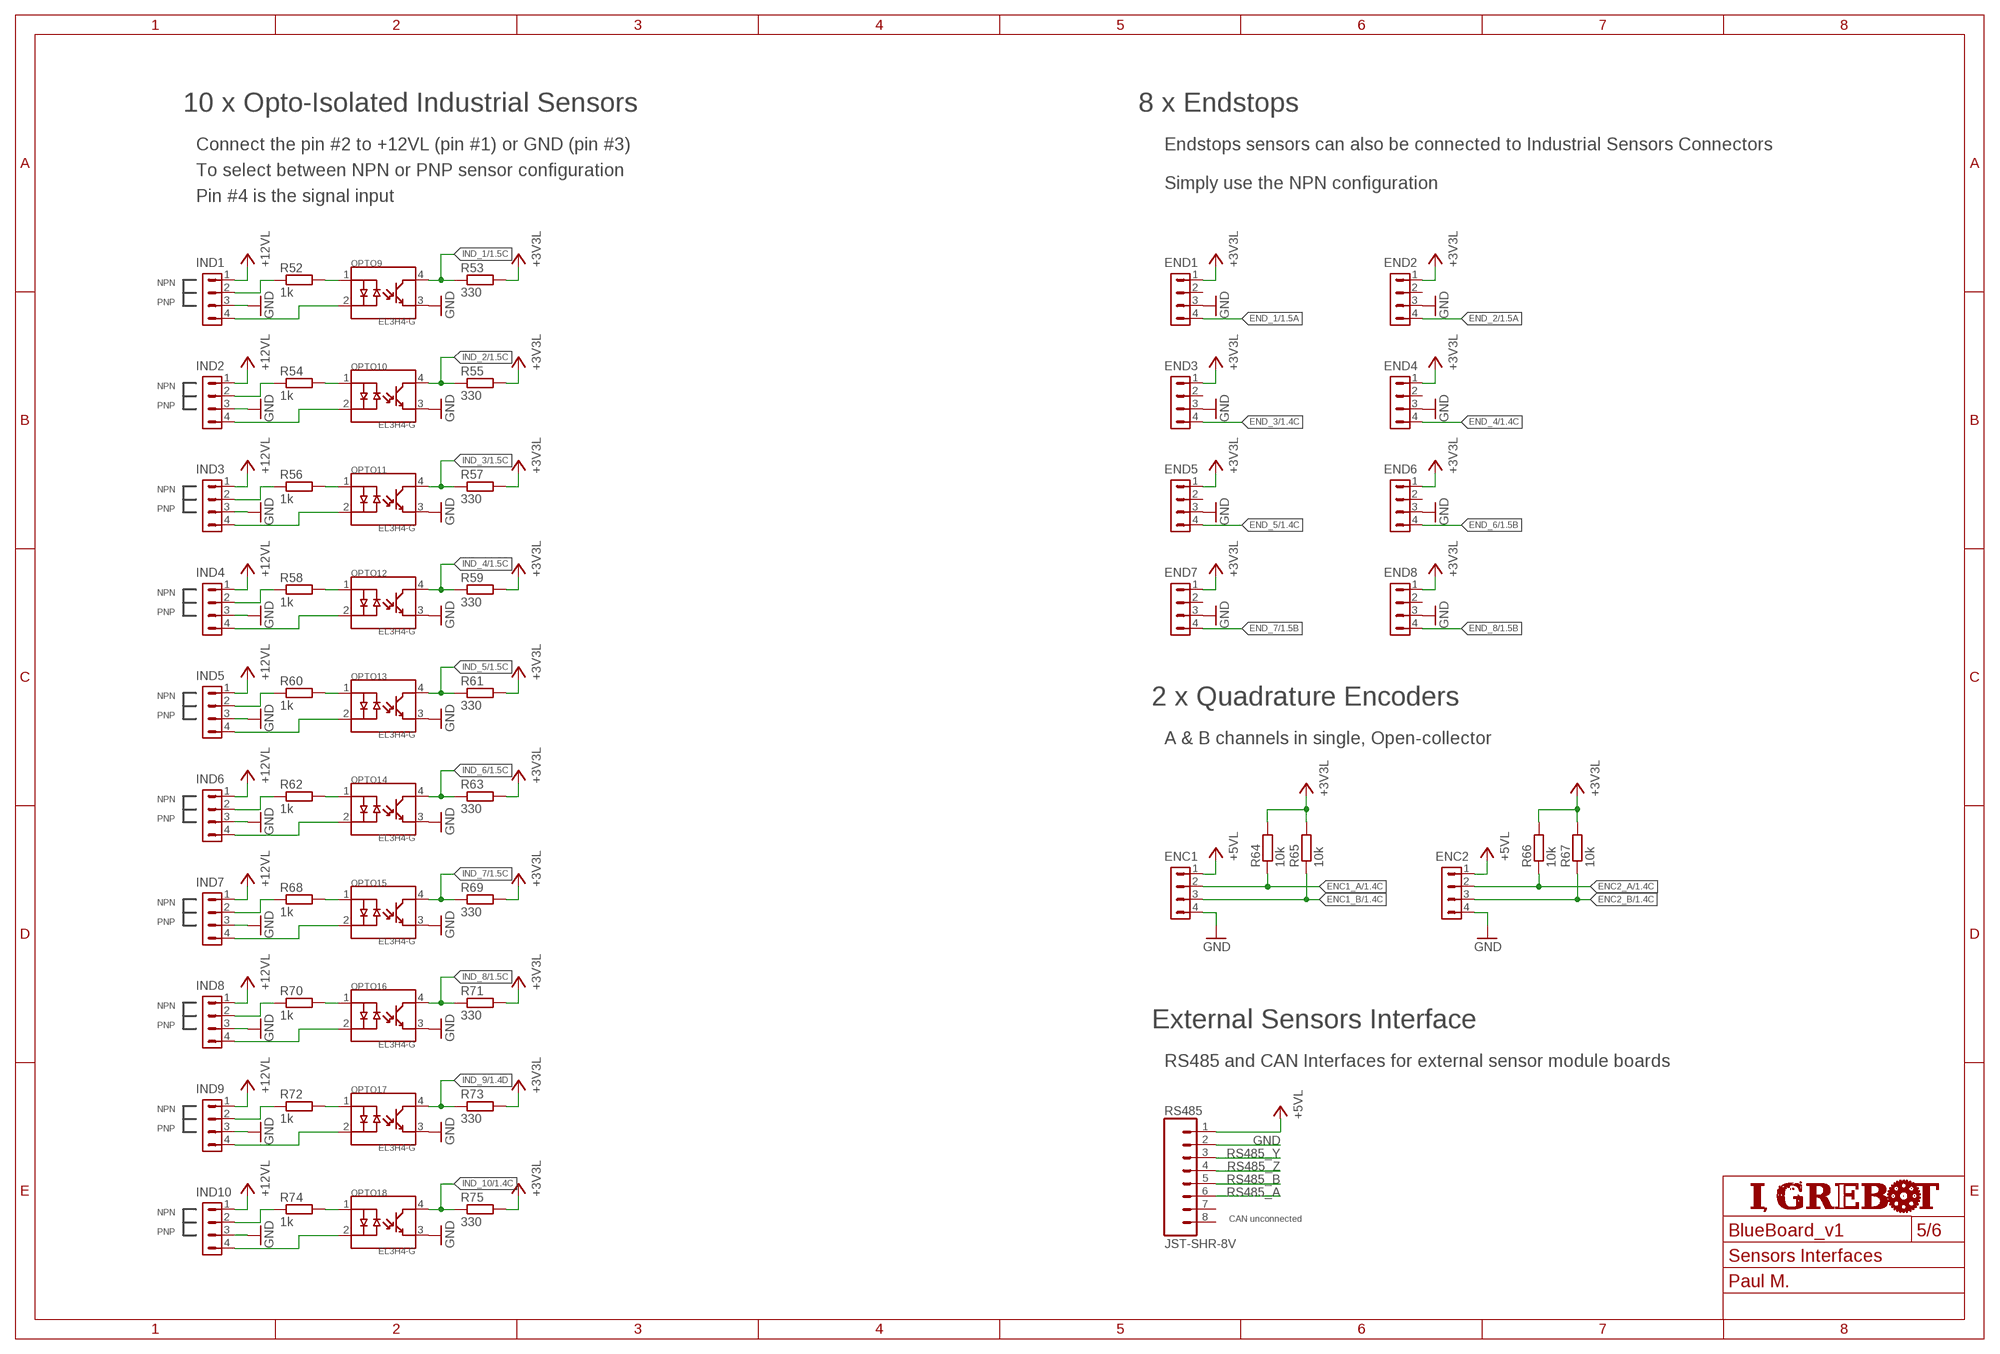
[diagram p4: schematic, sheet 5]
U$4 (FRAME_A3): AUTHOR: Paul M.; SHEET_NAME: Sensors Interfaces

### Parts
ENC1  CON_1.27_4  [CON_1.27_4]
ENC2  CON_1.27_4  [CON_1.27_4]
END1  CON_1.27_4  [CON_1.27_4]
END2  CON_1.27_4  [CON_1.27_4]
END3  CON_1.27_4  [CON_1.27_4]
END4  CON_1.27_4  [CON_1.27_4]
END5  CON_1.27_4  [CON_1.27_4]
END6  CON_1.27_4  [CON_1.27_4]
END7  CON_1.27_4  [CON_1.27_4]
END8  CON_1.27_4  [CON_1.27_4]
IND1  CON_1.27_4  [CON_1.27_4]
IND2  CON_1.27_4  [CON_1.27_4]
IND3  CON_1.27_4  [CON_1.27_4]
IND4  CON_1.27_4  [CON_1.27_4]
IND5  CON_1.27_4  [CON_1.27_4]
IND6  CON_1.27_4  [CON_1.27_4]
IND7  CON_1.27_4  [CON_1.27_4]
IND8  CON_1.27_4  [CON_1.27_4]
IND9  CON_1.27_4  [CON_1.27_4]
IND10  CON_1.27_4  [CON_1.27_4]
OPTO9  EL3H4-G  [SSOP_4]
OPTO10  EL3H4-G  [SSOP_4]
OPTO11  EL3H4-G  [SSOP_4]
OPTO12  EL3H4-G  [SSOP_4]
OPTO13  EL3H4-G  [SSOP_4]
OPTO14  EL3H4-G  [SSOP_4]
OPTO15  EL3H4-G  [SSOP_4]
OPTO16  EL3H4-G  [SSOP_4]
OPTO17  EL3H4-G  [SSOP_4]
OPTO18  EL3H4-G  [SSOP_4]
R52  1k  R-EU_R0603  [R0603]
R53  330  R-EU_R0603  [R0603]
R54  1k  R-EU_R0603  [R0603]
R55  330  R-EU_R0603  [R0603]
R56  1k  R-EU_R0603  [R0603]
R57  330  R-EU_R0603  [R0603]
R58  1k  R-EU_R0603  [R0603]
R59  330  R-EU_R0603  [R0603]
R60  1k  R-EU_R0603  [R0603]
R61  330  R-EU_R0603  [R0603]
R62  1k  R-EU_R0603  [R0603]
R63  330  R-EU_R0603  [R0603]
R64  10k  R-EU_R0603  [R0603]
R65  10k  R-EU_R0603  [R0603]
R66  10k  R-EU_R0603  [R0603]
R67  10k  R-EU_R0603  [R0603]
R68  1k  R-EU_R0603  [R0603]
R69  330  R-EU_R0603  [R0603]
R70  1k  R-EU_R0603  [R0603]
R71  330  R-EU_R0603  [R0603]
R72  1k  R-EU_R0603  [R0603]
R73  330  R-EU_R0603  [R0603]
R74  1k  R-EU_R0603  [R0603]
R75  330  R-EU_R0603  [R0603]
RS485  JST-SHR-8V  [JST-SHR-08V]

### Nets
+3V3L: END1.1 END2.1 END3.1 END4.1 END5.1 END6.1 END7.1 END8.1 R53.2 R55.2 R57.2 R59.2 R61.2 R63.2 R64.2 R65.2 R66.2 R67.2 R69.2 R71.2 R73.2 R75.2 ; also sheet 1,2,3,4,6
+5VL: ENC1.1 ENC2.1 RS485.1 ; also sheet 2,3,6
+12VL: IND1.1 IND2.1 IND3.1 IND4.1 IND5.1 IND6.1 IND7.1 IND8.1 IND9.1 IND10.1 ; also sheet 2
ENC1_A: ENC1.2 R64.1 ; also sheet 1
ENC1_B: ENC1.3 R65.1 ; also sheet 1
ENC2_A: ENC2.2 R66.1 ; also sheet 1
ENC2_B: ENC2.3 R67.1 ; also sheet 1
END_1: END1.4 ; also sheet 1
END_2: END2.4 ; also sheet 1
END_3: END3.4 ; also sheet 1
END_4: END4.4 ; also sheet 1
END_5: END5.4 ; also sheet 1
END_6: END6.4 ; also sheet 1
END_7: END7.4 ; also sheet 1
END_8: END8.4 ; also sheet 1
GND: ENC1.4 ENC2.4 END1.3 END2.3 END3.3 END4.3 END5.3 END6.3 END7.3 END8.3 IND1.3 IND2.3 IND3.3 IND4.3 IND5.3 IND6.3 IND7.3 IND8.3 IND9.3 IND10.3 OPTO9.3 OPTO10.3 OPTO11.3 OPTO12.3 OPTO13.3 OPTO14.3 OPTO15.3 OPTO16.3 OPTO17.3 OPTO18.3 RS485.2 ; also sheet 1,2,3,4,6
IND_1: OPTO9.4 R53.1 ; also sheet 1
IND_2: OPTO10.4 R55.1 ; also sheet 1
IND_3: OPTO11.4 R57.1 ; also sheet 1
IND_4: OPTO12.4 R59.1 ; also sheet 1
IND_5: OPTO13.4 R61.1 ; also sheet 1
IND_6: OPTO14.4 R63.1 ; also sheet 1
IND_7: OPTO15.4 R69.1 ; also sheet 1
IND_8: OPTO16.4 R71.1 ; also sheet 1
IND_9: OPTO17.4 R73.1 ; also sheet 1
IND_10: OPTO18.4 R75.1 ; also sheet 1
N$166: IND1.2 R52.1
N$167: OPTO9.1 R52.2
N$168: IND1.4 OPTO9.2
N$169: IND2.2 R54.1
N$170: OPTO10.1 R54.2
N$171: IND2.4 OPTO10.2
N$172: IND3.2 R56.1
N$173: OPTO11.1 R56.2
N$174: IND3.4 OPTO11.2
N$175: IND4.2 R58.1
N$176: OPTO12.1 R58.2
N$177: IND4.4 OPTO12.2
N$178: IND5.2 R60.1
N$179: OPTO13.1 R60.2
N$180: IND5.4 OPTO13.2
N$181: IND6.2 R62.1
N$182: OPTO14.1 R62.2
N$183: IND6.4 OPTO14.2
N$184: IND7.2 R68.1
N$185: OPTO15.1 R68.2
N$186: IND7.4 OPTO15.2
N$187: IND8.2 R70.1
N$188: OPTO16.1 R70.2
N$189: IND8.4 OPTO16.2
N$190: IND9.2 R72.1
N$191: OPTO17.1 R72.2
N$192: IND9.4 OPTO17.2
N$193: IND10.2 R74.1
N$194: OPTO18.1 R74.2
N$195: IND10.4 OPTO18.2
RS485_A: RS485.6 ; also sheet 6
RS485_B: RS485.5 ; also sheet 6
RS485_Y: RS485.3 ; also sheet 6
RS485_Z: RS485.4 ; also sheet 6
Unconnected: END1.2 END2.2 END3.2 END4.2 END5.2 END6.2 END7.2 END8.2 RS485.7 RS485.8

### Notes on the sheet
- 10 x Opto-Isolated Industrial Sensors | 8 x Endstops
- Connect the pin #2 to +12VL (pin #1) or GND (pin #3) | Endstops sensors can also be connected to Industrial Sensors Connectors
- To select between NPN or PNP sensor configuration
- Simply use the NPN configuration
- Pin #4 is the signal input
- NPN
- PNP
- NPN
- PNP
- NPN
- PNP
- NPN
- PNP
- NPN
- 2 x Quadrature Encoders
- PNP
- A & B channels in single, Open-collector
- NPN
- PNP
- NPN
- PNP
- NPN
- PNP | External Sensors Interface
- RS485 and CAN Interfaces for external sensor module boards
- NPN
- PNP
- NPN
- CAN unconnected
- PNP

## Sheet 6 of 6: Communication
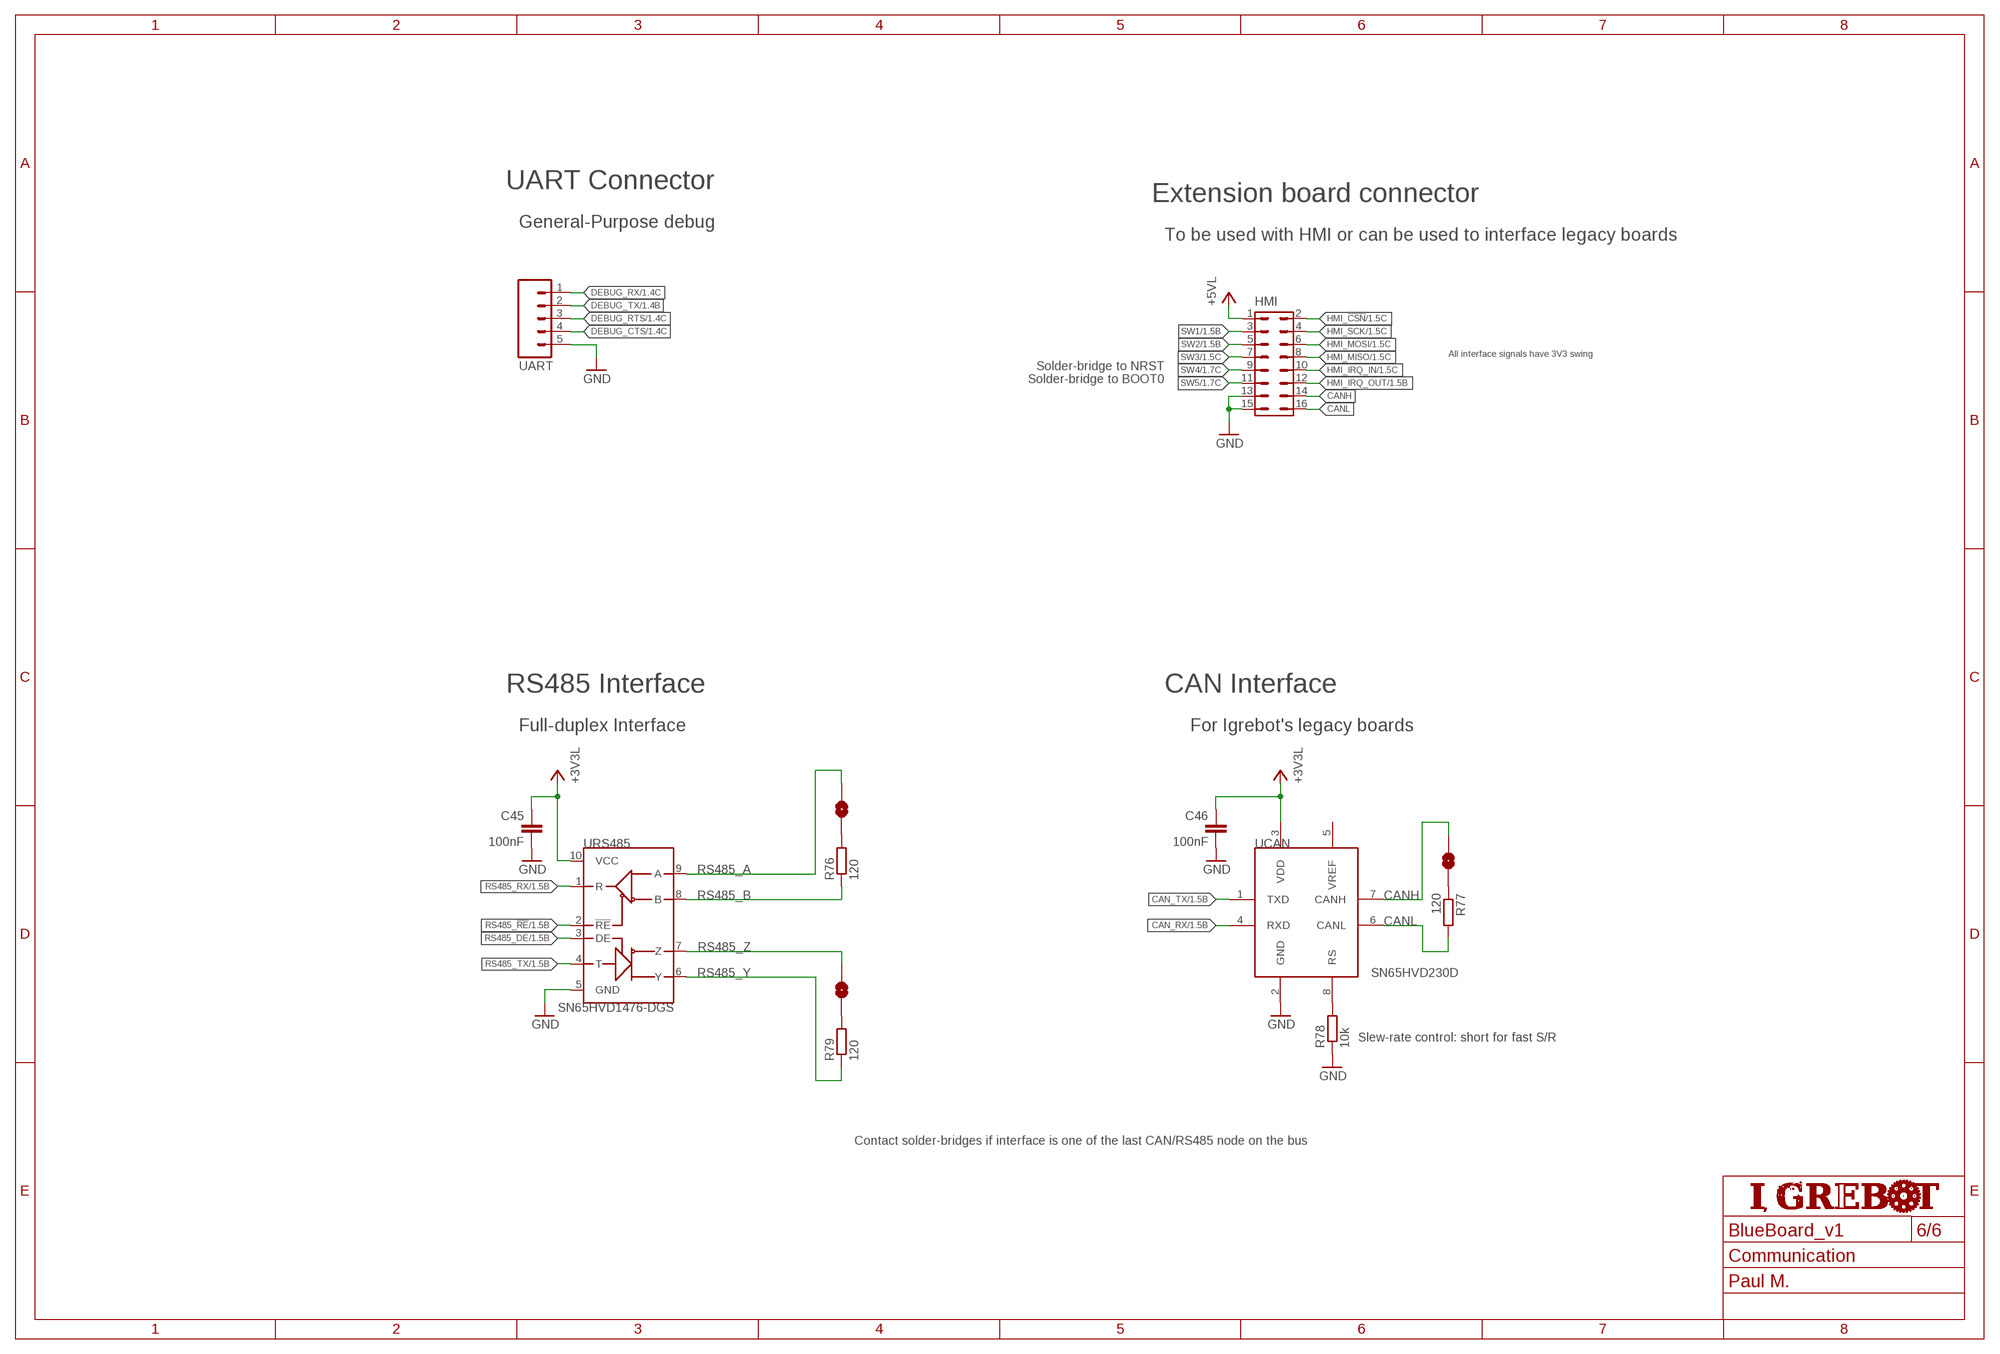
[diagram p5: schematic, sheet 6]
U$29 (FRAME_A3): AUTHOR: Paul M.; SHEET_NAME: Communication

### Parts
C45  100nF  C-EUC0603K  [C0603K]
C46  100nF  C-EUC0603  [C0603]
HMI  HE10_V_16  [CON_2X_2.54_V_16]
R76  120  R-EU_R0603  [R0603]
R77  120  R-EU_R0603  [R0603]
R78  10k  R-EU_R0603  [R0603]
R79  120  R-EU_R0603  [R0603]
SJ3  SOLDERJUMPERNC2  [SJ_2S-NOTRACE]
SJ4  SOLDERJUMPERNC2  [SJ_2S-NOTRACE]
SJ5  SOLDERJUMPERNC2  [SJ_2S-NOTRACE]
UART  M05LOCK  [1X05_LOCK]
UCAN  SN65HVD230D  MCP2551  [SO-08]
URS485  SN65HVD1476-DGS  [MSOP-10]

### Nets
+3V3L: C45.1 C46.1 UCAN.3(VDD) URS485.10(VCC) ; also sheet 1,2,3,4,5
+5VL: HMI.1 ; also sheet 2,3,5
CAN_RX: UCAN.4(RXD) ; also sheet 1
CAN_TX: UCAN.1(TXD) ; also sheet 1
CANH: HMI.14 SJ4.1 UCAN.7(CANH)
CANL: HMI.16 R77.2 UCAN.6(CANL)
DEBUG_CTS: UART.4 ; also sheet 1
DEBUG_RTS: UART.3 ; also sheet 1
DEBUG_RX: UART.1 ; also sheet 1
DEBUG_TX: UART.2 ; also sheet 1
GND: C45.2 C46.2 HMI.13 HMI.15 R78.1 UART.5 UCAN.2(GND) URS485.5(GND) ; also sheet 1,2,3,4,5
HMI_!CSN!: HMI.2 ; also sheet 1
HMI_IRQ_IN: HMI.10 ; also sheet 1
HMI_IRQ_OUT: HMI.12 ; also sheet 1
HMI_MISO: HMI.8 ; also sheet 1
HMI_MOSI: HMI.6 ; also sheet 1
HMI_SCK: HMI.4 ; also sheet 1
N$20: R78.2 UCAN.8(RS)
N$21: R77.1 SJ4.2
N$22: R76.2 SJ3.2
N$23: R79.2 SJ5.2
RS485_!RE!: URS485.2(!RE!) ; also sheet 1
RS485_A: SJ3.1 URS485.9(A) ; also sheet 5
RS485_B: R76.1 URS485.8(B) ; also sheet 5
RS485_DE: URS485.3(DE) ; also sheet 1
RS485_RX: URS485.1(R) ; also sheet 1
RS485_TX: URS485.4(T) ; also sheet 1
RS485_Y: R79.1 URS485.6(Y) ; also sheet 5
RS485_Z: SJ5.1 URS485.7(Z) ; also sheet 5
SW1: HMI.3 ; also sheet 1
SW2: HMI.5 ; also sheet 1
SW3: HMI.7 ; also sheet 1
SW4: HMI.9 ; also sheet 1
SW5: HMI.11 ; also sheet 1
Unconnected: UCAN.5(VREF)

### Notes on the sheet
- UART Connector
- Extension board connector
- General-Purpose debug
- To be used with HMI or can be used to interface legacy boards
- All interface signals have 3V3 swing
- Solder-bridge to NRST
- Solder-bridge to BOOT0
- RS485 Interface | CAN Interface
- Full-duplex Interface | For Igrebot's legacy boards
- Slew-rate control: short for fast S/R
- Contact solder-bridges if interface is one of the last CAN/RS485 node on the bus

## Library data of the parts
ASV1-ASV8 DSV3 = BlueBoard:CON_3.5_3
BAT1 = microLib:MC15-GF-3.81-LR_2
BAT2 = BlueBoard:JST-XH-S_5
C1-C13 C15 C17 C18 C20 C21 C23-C44 C46 = rcl:C-EU: CAPACITOR, European symbol
C14 C16 C19 C22 = rcl:CPOL-EU: POLARIZED CAPACITOR, European symbol
C45 = resistor:C-EU: CAPACITOR, European symbol
CEL1-CEL4 = microLib:LT1990
CX1 = BlueBoard:XTAL_5X3
DSV1 DSV2 = BlueBoard:CON_2.00_MOLEX-53253_3
ENC1 ENC2 END1-END8 IND1-IND10 = microLib:CON_1.27_4
HMI = BlueBoard:HE10_V_16
IBAT IP1-IP3 = microLib:INA138
L1-L3 = inductors:DR1030: DR1030 Series Low Profile Power Inductors Source: Data sheet <http://www.cooperbussmann.com/pdf/c73e479f-f867-4c64-ae26-9c1f23814163.pdf>
LED1 = BlueBoard:ASMB-MTB0-0A3A2
LED4-LED9 = led:LED: LED OSRAM: - CHIPLED LG R971, LG N971, LY N971, LG Q971, LY Q971, LO R971, LY R971 LH N974, LH R974 LS Q976, LO Q976, LY Q976 LO Q996 - Hyper CHIPLED LW Q18S LB Q993, LB Q99A, LB R99A - SideLED LS A670, LO A670, LY A670, LG A670, LP A670 LB A673, LV A673, LT A673, LW A673 LH A674 LY A675 LS A676, LA A676, LO A676, LY A676, LW A676 LS A679, LY A679, LG A679 - Hyper Micro SIDELED® LS Y876, LA Y876, LO Y876, LY Y876 LT Y87S - SmartLED LW L88C, LW L88S LB L89C, LB L89S, LG L890 LS L89K, LO L89K, LY L89K LS L896, LA L896, LO L896, LY L896 - TOPLED LS T670, LO T670, LY T670, LG T670, LP T670 LSG T670, LSP T670, LSY T670, LOP T670, LYG T670 LG T671, LOG T671, LSG T671 LB T673, LV T673, LT T673, LW T673 LH T674 LS T676, LA T676, LO T676, LY T676, LB T676, LH T676, LSB T676, LW T676 LB T67C, LV T67C, LT T67C, LS T67K, LO T67K, LY T67K, LW E67C LS E67B, LA E67B, LO E67B, LY E67B, LB E67C, LV E67C, LT E67C LW T67C LS T679, LY T679, LG T679 LS T770, LO T770, LY T770, LG T770, LP T770 LB T773, LV T773, LT T773, LW T773 LH T774 LS E675, LA E675, LY E675, LS T675 LS T776, LA T776, LO T776, LY T776, LB T776 LHGB T686 LT T68C, LB T68C - Hyper Mini TOPLED® LB M676 - Mini TOPLED Santana® LG M470 LS M47K, LO M47K, LY M47K Source: http://www.osram.convergy.de LUXEON: - LUMILED® LXK2-PW12-R00, LXK2-PW12-S00, LXK2-PW14-U00, LXK2-PW14-V00 LXK2-PM12-R00, LXK2-PM12-S00, LXK2-PM14-U00 LXK2-PE12-Q00, LXK2-PE12-R00, LXK2-PE12-S00, LXK2-PE14-T00, LXK2-PE14-U00 LXK2-PB12-K00, LXK2-PB12-L00, LXK2-PB12-M00, LXK2-PB14-N00, LXK2-PB14-P00, LXK2-PB14-Q00 LXK2-PR12-L00, LXK2-PR12-M00, LXK2-PR14-Q00, LXK2-PR14-R00 LXK2-PD12-Q00, LXK2-PD12-R00, LXK2-PD12-S00 LXK2-PH12-R00, LXK2-PH12-S00 LXK2-PL12-P00, LXK2-PL12-Q00, LXK2-PL12-R00 Source: www.luxeon.com KINGBRIGHT: KA-3528ASYC Source: www.kingbright.com
LOGO_IGREBOT = BlueBoard:LOGO_IGREBOT
LOGO_LAYERS = BlueBoard:LAYERS_CHECK
MOT1 MOT2 VCC1-VCC3 VP1-VP3 = BlueBoard:CON_3.5_2
OPA1 OPA2 = burr-brown:OPA4340: Operational Amplifiers Source: http://focus.ti.com/lit/ds/sbos073/sbos073.pdf; MF: TEXAS INSTRUMENTS; MPN: OPA4340UA; OC_FARNELL: 1212307; OC_NEWARK: 35C1907
OPTO1-OPTO8 = microLib:EL3H7-G
OPTO9-OPTO18 = microLib:EL3H4-G
P1 = resistor:R-TRIMM: Trimm resistor
Q1-Q3 = SparkFun-DiscreteSemi:MOSFET-NCHANNEL: Common NMOSFET Parts MFG P/N Store ID Prod ID FDD8780 TRANS-09984 SI7820DN TRANS-11055 FDS6630A IC-08089 2N7002PW TRANS-11151 FQP30N06L COM-10213 TRANS-10060 BSS123LT1G TRANS-08345 BSS138 TRANS-00830 BS170 2N7000; PROD_ID: TRANS-00830
R1-R4 R16-R20 R23 R26 R29 R34-R75 R80 R81 = resistor:R-EU_: RESISTOR, European symbol
R5-R15 R21 R22 R24 R25 R27 R28 R30-R33 R76-R79 R82-R84 = rcl:R-EU_: RESISTOR, European symbol
RS485 = ProxTof:JST-SHR-8V
RTC = SparkFun-Connectors:M03: Header 3 Standard 3-pin 0.1" header. Use with straight break away headers (SKU : PRT-00116), right angle break away headers (PRT-00553), swiss pins (PRT-00743), machine pins (PRT-00117), and female headers (PRT-00115). Molex polarized connector foot print use with SKU : PRT-08232 with associated crimp pins and housings.
SJ1-SJ5 = ProxTof:SOLDERJUMPER: Solder Jumper Standard SMD solder jumper. Used to automate production. Two varients : Normally Open and Normally Closed are the same, but have different paste layers. NC will have a large amount of paste and should jumper during reflow.
STM32 = BlueBoard:STM32F746VG
SWD = SparkFun-Connectors:M06: Header 6 Standard 6-pin 0.1" header. Use with straight break away headers (SKU : PRT-00116), right angle break away headers (PRT-00553), swiss pins (PRT-00743), machine pins (PRT-00117), and female headers (PRT-00115). Molex polarized connector foot print use with SKU : PRT-08094 with associated crimp pins and housings. NOTES ON THE VARIANTS LOCK and LOCK_LONGPADS... This footprint was designed to help hold the alignment of a through-hole component (i.e. 6-pin header) while soldering it into place. You may notice that each hole has been shifted either up or down by 0.005 of an inch from it's more standard position (which is a perfectly straight line). This slight alteration caused the pins (the squares in the middle) to touch the edges of the holes. Because they are alternating, it causes a "brace" to hold the component in place. 0.005 has proven to be the perfect amount of "off-center" position when using our standard breakaway headers. Although looks a little odd when you look at the bare footprint, once you have a header in there, the alteration is very hard to notice. Also,if you push a header all the way into place, it is covered up entirely on the bottom side. This idea of altering the position of holes to aid alignment will be further integrated into the Sparkfun Library for other footprints. It can help hold any component with 3 or more connection pins.
SWITCHS = microLib:MC15-GF-3.81-LR_4
U3V3L U5VL U12VL = microLib:TSR_1-24XX
UART = SparkFun-Connectors:M05: Header 5 Standard 5-pin 0.1" header. Use with straight break away headers (SKU : PRT-00116), right angle break away headers (PRT-00553), swiss pins (PRT-00743), machine pins (PRT-00117), and female headers (PRT-00115). Molex polarized connector foot print use with SKU : PRT-08230 with associated crimp pins and housings.
UCAN = 0SBLib:MCP2551: High-Speed CAN Transceiver
UMOT = microLib:MODULE_DRV8843
URS485 = ProxTof:SN65HVD1476
USB = con-cypressindustries:MINI-USB-: MINI USB-B Conector Source: www.cypressindustries.com; OC_FARNELL: unknown; OC_NEWARK: unknown
UVP1-UVP3 = BlueBoard:PTN78060W
VREF = maxim:MAX6520: 1.2V Voltage Reference 50ppm/°C, SOT23, 3-Terminal Source: Data sheet <http://datasheets.maxim-ic.com/en/ds/MAX6520.pdf>; MF: MAXIM; MPN: MAX6520EUR-T; OC_FARNELL: unknown; OC_NEWARK: 02J4586